# Altium schematic sheet SE-HV00-02.SchDoc
size A4
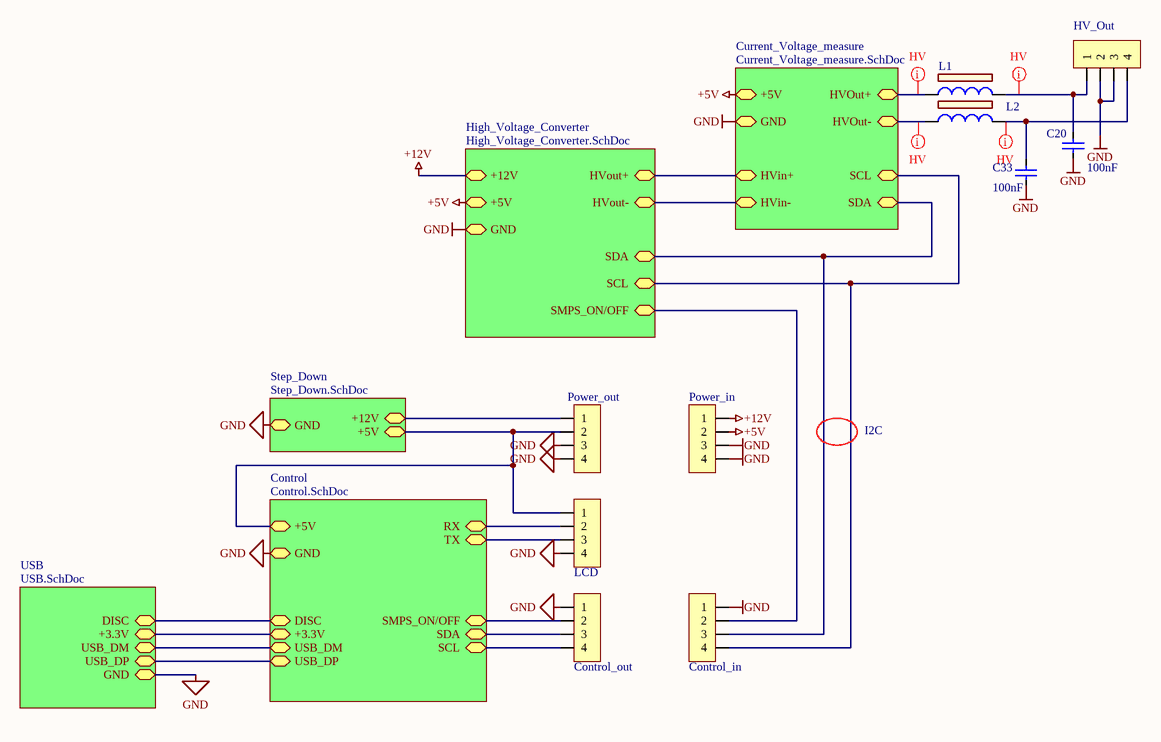
[diagram p0: SE-HV00-02.SchDoc]

## Parts
C20  100nF  [C1808]
C33  100nF  [C1808]
Control_in  4 Pin Socket  [RA Socket 4 pin]  (value not drawn)
Control_out  HDR 4 Pin  [RA HDR 4Pin]  (value not drawn)
HV_Out  HDR 4  [HDR1X4_3M96V]  (value not drawn)
L1  (no value)  [LL0805\2P]
L2  (no value)  [LL0805\2P]
LCD  B4B-XH-A  [B4B-XH-A]  (value not drawn)
Power_in  4 Pin Socket  [RA Socket 4 pin]  (value not drawn)
Power_out  HDR 4 Pin  [RA HDR 4Pin]  (value not drawn)

## Sub-sheets
Control = Control.SchDoc: +5V, GND, USB_DM, USB_DP, RX, TX, SDA, SCL, DISC, SMPS_ON/OFF, +3.3V
Current_Voltage_measure = Current_Voltage_measure.SchDoc: HVin+, HVin-, SDA, SCL, +5V, GND, HVOut+, HVOut-
High_Voltage_Converter = High_Voltage_Converter.SchDoc: +12V, GND, HVout+, HVout-, SDA, SCL, SMPS_ON/OFF, +5V
Step_Down = Step_Down.SchDoc: +12V, GND, +5V
USB = USB.SchDoc: USB_DP, USB_DM, DISC, +3.3V, GND

## Nets
+5V: Power_in.2 ; sheet High_Voltage_Converter/+5V, sheet Current_Voltage_measure/+5V
+12V: Power_in.1 ; sheet High_Voltage_Converter/+12V
GND: C20.1 C33.1 Control_in.1 Control_out.1 HV_Out.2 HV_Out.3 LCD.4 Power_in.3 Power_in.4 Power_out.3 Power_out.4 ; sheet Step_Down/GND, sheet High_Voltage_Converter/GND, sheet USB/GND, sheet Control/GND, sheet Current_Voltage_measure/GND
NetC20_2: C20.2 HV_Out.1 L1.2
NetC33_2: C33.2 HV_Out.4 L2.2
NetControl_in_2: Control_in.2 ; sheet High_Voltage_Converter/SMPS_ON/OFF
NetControl_in_3: Control_in.3 ; sheet High_Voltage_Converter/SDA, sheet Current_Voltage_measure/SDA
NetControl_in_4: Control_in.4 ; sheet High_Voltage_Converter/SCL, sheet Current_Voltage_measure/SCL
NetControl_out_2: Control_out.2 ; sheet Control/SMPS_ON/OFF
NetControl_out_3: Control_out.3 ; sheet Control/SDA
NetControl_out_4: Control_out.4 ; sheet Control/SCL
NetL1_1: L1.1 ; sheet Current_Voltage_measure/HVOut+
NetL2_1: L2.1 ; sheet Current_Voltage_measure/HVOut-
NetLCD_1: LCD.1 Power_out.2 ; sheet Step_Down/+5V, sheet Control/+5V
NetLCD_2: LCD.2 ; sheet Control/RX
NetLCD_3: LCD.3 ; sheet Control/TX
NetPower_out_1: Power_out.1 ; sheet Step_Down/+12V
(unnamed): sheet High_Voltage_Converter/HVout+, sheet Current_Voltage_measure/HVin+
(unnamed): sheet High_Voltage_Converter/HVout-, sheet Current_Voltage_measure/HVin-
(unnamed): sheet USB/USB_DP, sheet Control/USB_DP
(unnamed): sheet USB/USB_DM, sheet Control/USB_DM
(unnamed): sheet USB/DISC, sheet Control/DISC
(unnamed): sheet USB/+3.3V, sheet Control/+3.3V

## Layout directives
net class HV: NetC20_2, NetC33_2, NetL1_1, NetL2_1

## Notes on the sheet
- I2C

## Library data of the parts
C20 C33 = C0000111: MLCC, X7R, 100NF, 630V, 1808; Manufacturer: KEMET; Manufacturer Part Number: C1808V104KBRACTU; Voltage: 630; Tolerance: ± 10%; Part Number: C0000111; Part Type: MLCC; Material: X7R; Package: C1808; SMD: Yes; Supplier 1: Farnell; Supplier 2: Mouser; Supplier Part Number 2: 2085209; ComponentLink1Description: MFG link
Control_in Power_in = Right angle socket conn 2.54, single row: Right angle socket conn 2.54mm single row
Control_out Power_out = Right angle haeder 2.54 mm single row
HV_Out = J0000151: CONNECTOR, 4 way , HEADER, THT, 3.96MM,10A,250Vac; Manufacturer: JST; Manufacturer Part Number: B4P-VH(LF)(SN); Gender: Male; Project: RALIS; Note: S; Manufacturer Code: *; Notes: *; Aproved: -; Part Number: J0000151; Part Type: Connector\Wire to Board; Pitch: 3.96MM; SMD: No; Supplier 1: Farnell; Supplier Part Number 1: 9492020; Supplier 2: Digi-Key; Supplier Part Number 2: 455-1641-ND; ComponentLink1Description: MFG link; ComponentLink1URL: http://www.jst-mfg.com/product/detail_e.php?series=262; Data: 2014-12-15
L1 L2 = L0000002: BEAD SMD EMI FERRITE 0805 220 OHM; Manufacturer: Murata; Manufacturer Part Number: BLM21PG221SN1D; Resistance: 220 OHM; Part Number: L0000002; Part Type: Ferrite\Bead; SMD: Yes; ComponentLink1Description: MFG link; ComponentLink2Description: DataSheet; Data: 2011-01-26
LCD = J0000086: Wire to Board Header, THT, 2.5MM, 4WAY; Manufacturer: JST; Manufacturer Part Number: B4B-XH-A (LF)(SN); Gender: Pin (Male); Note: S; Manufacturer Code: *; Notes: *; Aproved: -; Part Number: J0000086; Part Type: Connector\Wire to Board; Orientation: Straight PCB PTH; Pitch: 2.5mm; SMD: No; Supplier 1: Farnell; Supplier Part Number 1: 1516278; Supplier 2: Digikey; Supplier Part Number 2: 455-2249-ND; ComponentLink1Description: MFG link; ComponentLink1URL: http://www.farnell.com/datasheets/5448.pdf; Data: 2012-06-06